# Altium schematic sheet BlueToothi.SchDoc
size A4
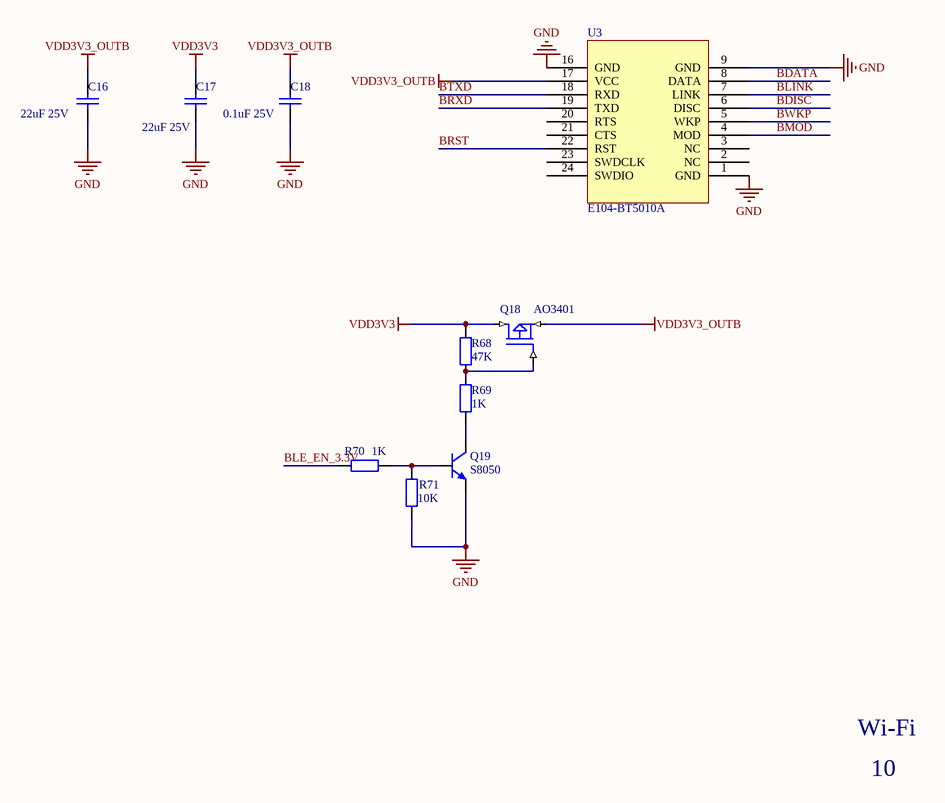
[diagram p0: BlueToothi.SchDoc]

## Parts
C16  22uF 25V  [SMD-0805C]
C17  22uF 25V  [SMD-0805C]
C18  0.1uF 25V  [SMD-0805C]
Q18  AO3401  [SOT-23]
Q19  S8050  [SOT-23]
R68  47K  [SMD-0603]
R69  1K  [SMD-0603]
R70  1K  [SMD-0603]
R71  10K  [SMD-0603]
U3  E104-BT5010A  [E104-BT503]

## Nets
GND: C16.1 C17.1 C18.1 Q19.2(E) R71.1 U3.1(GND) U3.9(GND) U3.16(GND)
VDD3V3: C17.2 Q18.2(D) R68.1
VDD3V3_OUTB: C16.2 C18.2 Q18.3(S) U3.17(VCC)
BDATA: U3.8(DATA)
BDISC: U3.6(DISC)
BLE_EN_3.3V: R70.1
BLINK: U3.7(LINK)
BMOD: U3.4(MOD)
BRST: U3.22(RST)
BRXD: U3.19(TXD)
BTXD: U3.18(RXD)
BWKP: U3.5(WKP)
NetQ18_1: Q18.1(G) R68.2 R69.2
NetQ19_1: Q19.1(B) R70.2 R71.2
NetQ19_3: Q19.3(C) R69.1

Not connected (* = marked no-connect by the designer): U3 2(NC) 3(NC) 20(RTS) 21(CTS) 23(SWDCLK) 24(SWDIO)

## Notes on the sheet
- Wi-Fi
- 10

## Library data of the parts
C16-C18 = CAP4: 贴片电容 20%
Q18 = MOSFET P
Q19 = NPN-1: NPN
R68-R71 = R: 贴片电阻 5%
U3 = E104-BT503